# Altium schematic sheet IO.SchDoc
size Letter; Organization: Penn Electric Racing; Address1: 220 S. 33rd St; Address2: Towne Bldg B11; Address3: Philadelpia, PA 19104; Address4: USA; DocumentNumber: 7; SheetNumber: 7; SheetTotal: 7
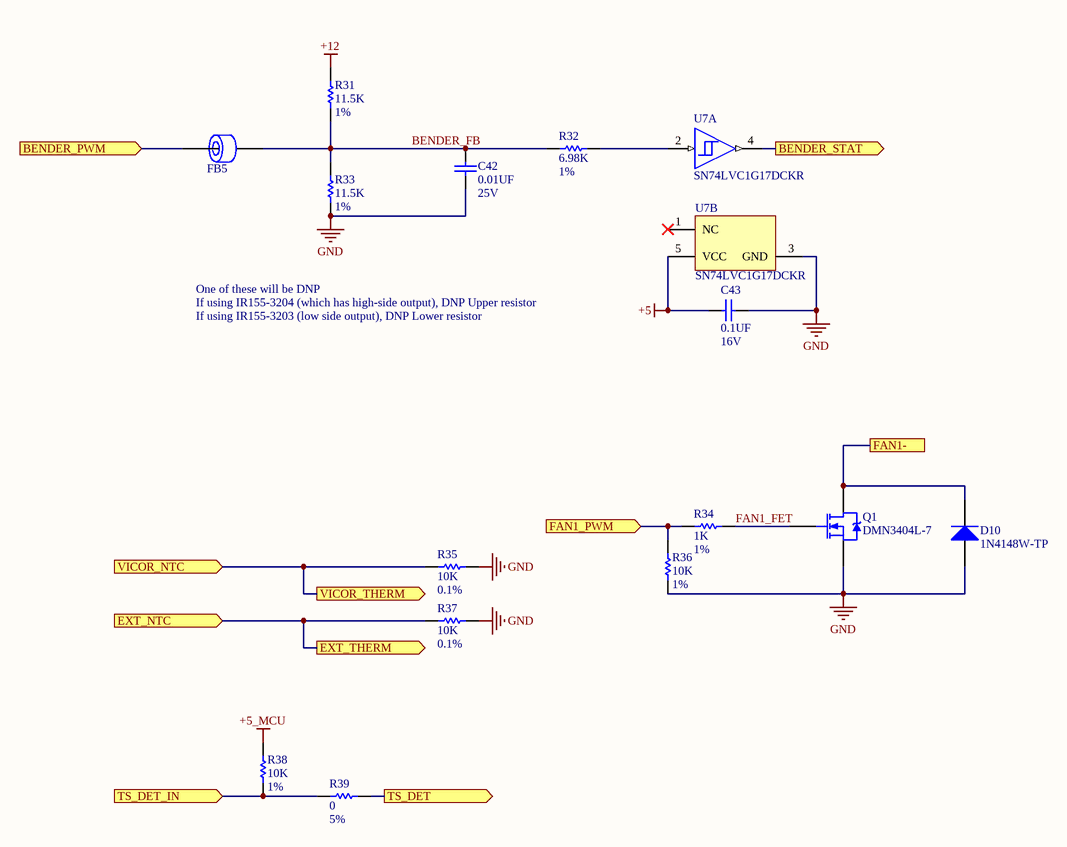
[diagram p0: IO.SchDoc]

## Parts
C42  Val: 0.01UF  Vol: 25V  [0603_CAP]  (hidden comment: CAP 0603 0.01UF 25V 10% X7R)
C43  Val: 0.1UF  Vol: 16V  [0603_CAP]  (hidden comment: CAP 0603 0.1UF 16V 10% X7R)
D10  1N4148W-TP  [MCC-SOD123_V]
FB5  Ferrite Chip 2500 Ohms  [0603]  (value not drawn)
Q1  DMN3404L-7  [SOT23-FET-DI]
R31  Val: 11.5K  Tol: 1%  [0603_RES]  (hidden comment: RES 0603 11.5K 1%)
R32  Val: 6.98K  Tol: 1%  [0603_RES]  (hidden comment: RES 0603 6.98K 1%)
R33  Val: 11.5K  Tol: 1%  [0603_RES]  (hidden comment: RES 0603 11.5K 1%)
R34  Val: 1K  Tol: 1%  [0603_RES]  (hidden comment: RES 0603 1K 1%)
R35  Val: 10K  Tol: 0.1%  [0603_RES]  (hidden comment: RES 0603 10K 0.1%)
R36  Val: 10K  Tol: 1%  [0603_RES]  (hidden comment: RES 0603 10K 1%)
R37  Val: 10K  Tol: 0.1%  [0603_RES]  (hidden comment: RES 0603 10K 0.1%)
R38  Val: 10K  Tol: 1%  [0603_RES]  (hidden comment: RES 0603 10K 1%)
R39  Val: 0  Tol: 5%  [0603_RES]  (hidden comment: RES 0603 0 5%)
U7  SN74LVC1G17DCKR  [DCK0005A_L]  (parts A,B of 2)

## Ports
BENDER_PWM (in), BENDER_STAT (out), EXT_NTC (in), EXT_THERM (out), FAN1-, FAN1_PWM (in), TS_DET (out), TS_DET_IN (in), VICOR_NTC (in), VICOR_THERM (out)

## Nets
+5: C43.1 U7.5(VCC)
+5_MCU: R38.2
+12: R31.2
GND: C42.1 C43.2 D10.1(A) Q1.2(S) R33.1 R35.2 R36.1 R37.2 U7.3(GND)
BENDER_FB: C42.2 FB5.2 R31.1 R32.2 R33.2
BENDER_PWM: FB5.1 ; port BENDER_PWM
BENDER_STAT: U7.4(Y) ; port BENDER_STAT
EXT_NTC: R37.1 ; port EXT_THERM, port EXT_NTC
FAN1-: D10.2(K) Q1.3(D) ; port FAN1-
FAN1_FET: Q1.1(G) R34.2
FAN1_PWM: R34.1 R36.2 ; port FAN1_PWM
TS_DET: R39.2 ; port TS_DET
TS_DET_IN: R38.1 R39.1 ; port TS_DET_IN
VICOR_NTC: R35.1 ; port VICOR_THERM, port VICOR_NTC
NetR32_1: R32.1 U7.2(A)

Not connected (* = marked no-connect by the designer): U7 1(NC)*

## Notes on the sheet
- One of these will be DNP
- If using IR155-3204 (which has high-side output), DNP Upper resistor
- If using IR155-3203 (low side output), DNP Lower resistor
- Title:
- Size:
- Date:
- Desc:
- Letter
- Auth:
- Sheet
- Proj:
- *
- of
- www.uvmaero.org
- File:

## Library data of the parts
C42 = CAP 0603 0.01UF 25V 10% X7R: Capacitor Surface Mount 0603 Footprint 0.01UF 25V 10% Tolerance Ceramic X7R; Manufacturer: Various; PCB Package: 0603; Description in Visual: Cap SMT 0603 0.01UF 25V 10%  Cer X7R; P/N: CAP 0603 0.01UF 25V 10% X7R; Manufacturer P/N: Various; Value: 0.01UF; Voltage: 25V; Tolerance: 10%; Type: Ceramic X7R; ComponentLink1Description: Manufacturer Website; ComponentLink2Description: Component Datasheet; ComponentLink3Description: Octopart Link
C43 = CAP 0603 0.1UF 16V 10% X7R: Capacitor Surface Mount 0603 Footprint 0.1UF 16V 10% Tolerance Ceramic X7R; Manufacturer: Various; PCB Package: 0603; Description in Visual: Cap SMT 0603 0.1UF 16V 10%  Cer X7R; P/N: CAP 0603 0.1UF 16V 10% X7R; Manufacturer P/N: Various; Value: 0.1UF; Voltage: 16V; Tolerance: 10%; Type: Ceramic X7R; ComponentLink1Description: Manufacturer Website; ComponentLink2Description: Component Datasheet; ComponentLink3Description: Octopart Link
D10 = CMP-2000-04993-1: High Speed Switching Diode, 400 mW, 150 mA, -65 to 150 degC, 2-Pin SOD123, RoHS, Tape and Reel; Manufacturer: Micro Commercial Components; Reverse Recovery Time-Max: 4ns; Average Forward Current-Max: 0.15A; Peak Current-Max: 2A; Power Dissipation: 400mW; Reverse Voltage-Max [Vrrm]: 100V; Datasheet URL: https://datasheet.ciiva.com/16836/1n4148wsod123-16836277.pdf; Package Reference: SOD123; Package URL: http://www.mccsemi.com/up_pdf/1N4448W(SOD-123).pdf; Package Description: 2-Pin Small Outline Diode, Body 2.7 x 1.6 mm, Height 1.35 mm; Manufacturer URL: http://www.mccsemi.com/; Datasheet Version: Rev. C, 07/2014
FB5 = MMZ1608A252B: Ferrite Chip 200 mA 2500 Ohms Differential Mode - Single 0603 Footprint; Manufacturer: TDK; Description in Visual: Ferrite SMT 200mA 2500Ohm Dif Mode 0603; Usage: Signal Line; Current (mA): 200; Frequency: 100 MHz; Impedance at Freq (ohms): 2500; DC Resistance (ohms): 0.8; P/N: MMZ1608A252B; Manufacturer P/N: MMZ1608A252B; Filter type: Differential Mode - Single; Operating Temperature Range: -55 to +125 °C; PCB Package: 0603; ComponentLink1Description: Manufacturer Website; ComponentLink1URL: http://www.tdk.com/; ComponentLink2Description: Component Datasheet; ComponentLink2URL: http://www.tdk.co.jp/tefe02/e9412_mmz1608.pdf; ComponentLink3Description: Octopart Link; ComponentLink3URL: http://octopart.com/partsearch/#search/requestData&q=MMZ1608A252B
Q1 = DMN3404L-7: N-Channel 30V 5.8A (Ta) 720mW (Ta) Surface Mount SOT-23-3; Manufacturer: Diodes; Drain to Source Resistance: 82mR; Element Configuration: Single; Fall Time: 6.18ns; Gate to Source Voltage (Vgs): 20V; Input Capacitance: 386pF; Max Power Dissipation: 1.4W; Nominal Vgs: 1.5V; Number of Channels: 1; On-State Resistance: 28mR; Turn-Off Delay Time: 13.92ns; Turn-On Delay Time: 3.41ns; Case/Package: SOT-23; Category: MOSFETs; Contact Plating: Tin,Matte; Continuous Drain Current (ID): 5.8A; Drain to Source Breakdown Voltage: 30V; Drain to Source Voltage (Vdss): 30V; Height: 1mm; Lead Free: Lead Free; Length: 2.9mm; Manufacturer Part Number: DMN3404L-7; Max Operating Temperature: 150°C; Min Operating Temperature: -55°C; Mount: Surface Mount; Number of Elements: 1; Number of Pins: 3; Package Quantity: 3000; Packaging: Tape and Reel; Power Dissipation: 1.4W; Rds On Max: 28mR; REACH SVHC: No SVHC; Rise Time: 6.18ns; Threshold Voltage: 1.5V; Weight: 0.000282oz; Width: 1.3mm; Supplier 1: Digi-Key; Supplier Part Number 1: DMN3404LDICT-ND
R31 R33 = RES 0603 11.5K 1%: Resistor Surface Mount, 11.5K Ohms, 0603 Footprint, 1% Tolerance 0.1W; Manufacturer: Various; PCB Package: 0603; Description in Visual: Res SMT 11.5K 0603  1%  0.1W; P/N: RES 0603 11.5K 1%; Manufacturer P/N: Various; Value: 11.5K; Power_Rating: 0.1W; Tolerance: 1%
R32 = RES 0603 6.98K 1%: Resistor Surface Mount, 6.98K Ohms, 0603 Footprint, 1% Tolerance 0.1W; Manufacturer: Various; PCB Package: 0603; Description in Visual: Res SMT 6.98K 0603  1%  0.1W; P/N: RES 0603 6.98K 1%; Manufacturer P/N: Various; Value: 6.98K; Power_Rating: 0.1W; Tolerance: 1%
R34 = RES 0603 1K 1%: Resistor Surface Mount, 1K Ohms, 0603 Footprint, 1% Tolerance 0.1W; Manufacturer: Various; PCB Package: 0603; Description in Visual: Res SMT 1K 0603  1%  0.1W; P/N: RES 0603 1K 1%; Manufacturer P/N: Various; Value: 1K; Power_Rating: 0.1W; Tolerance: 1%
R35 R37 = RES 0603 10K 0.1%: Resistor Surface Mount, 10K Ohms, 0603 Footprint, 0.1% Tolerance 0.1W; Manufacturer: Various; PCB Package: 0603; Description in Visual: Res SMT 10K 0603  0.1%  0.1W; P/N: RES 0603 10K 0.1%; Manufacturer P/N: Various; Value: 10K; Power_Rating: 0.1W; Tolerance: 0.1%
R36 R38 = RES 0603 10K 1%: Resistor Surface Mount, 10K Ohms, 0603 Footprint, 1% Tolerance 0.1W; Manufacturer: Various; PCB Package: 0603; Description in Visual: Res SMT 10K 0603  1%  0.1W; P/N: RES 0603 10K 1%; Manufacturer P/N: Various; Value: 10K; Power_Rating: 0.1W; Tolerance: 1%
R39 = RES 0603 0 5%: Resistor Surface Mount, 0 Ohms, 0603 Footprint, 5% Tolerance 0.1W; Manufacturer: Various; PCB Package: 0603; Description in Visual: Res SMT 0 0603  5%  0.1W; Value: 0; P/N: RES 0603 0 5%; Manufacturer P/N: Various; Power_Rating: 0.1W; Tolerance: 5%
U7 = CMP-0859-00388-4: Single Schmitt-Trigger Buffer, DCK0005A, LARGE T&R; Manufacturer: Texas Instruments; tpd @ Nom Voltage(Max)(ns): 11,6.5,5.5,5; Bits(#): 1; VCC(Min)(V): 1.65; F @ Nom Voltage(Max)(Mhz): 150; VCC(Max)(V): 5.5; Input Type: CMOS/TTL; Sub-Family: Non-Inverting Buffer/Driver; Output Type: CMOS; Output Drive (IOL/IOH)(Max)(mA): 32/-32; 3-State Output: No; Logic: True; ICC @ Nom Voltage(Max)(mA): 0.01; Voltage(Nom)(V): 1.8,2.5,3.3,5; Rating: Catalog; Schmitt Trigger: Yes; Technology Family: LVC; PackageReference: DCK0005A; DatasheetVersion: SCES351V; Generic Part Number: SN74LVC1G17; Operating Temperature Range(C): -40 to 125,-40 to 85